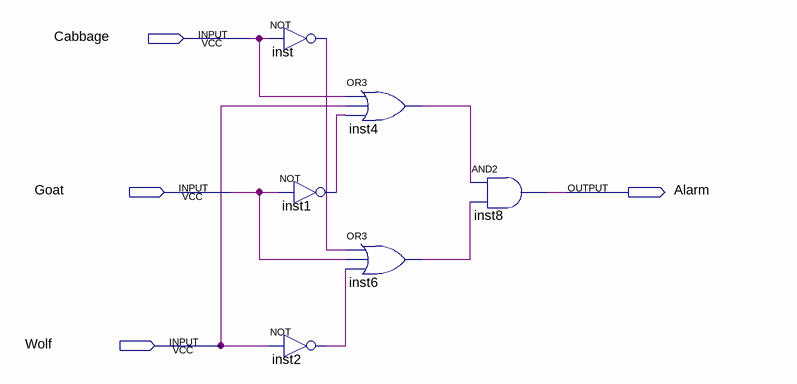
[diagram p0: schematic sheet]
// Quartus schematic lab2step2.bdf as structural Verilog: 6 symbols, 4 pins
module lab2step2 (
  input  Cabbage,
  input  Goat,
  input  Wolf,
  output Alarm
);

  wire inst1_out, inst2_out, inst4_out, inst6_out, inst_out;

  not inst (inst_out, Cabbage);
  not inst1 (inst1_out, Goat);
  not inst2 (inst2_out, Wolf);
  or inst4 (inst4_out, Cabbage, Wolf, inst1_out);
  or inst6 (inst6_out, inst_out, Goat, inst2_out);
  and inst8 (Alarm, inst4_out, inst6_out);
endmodule
